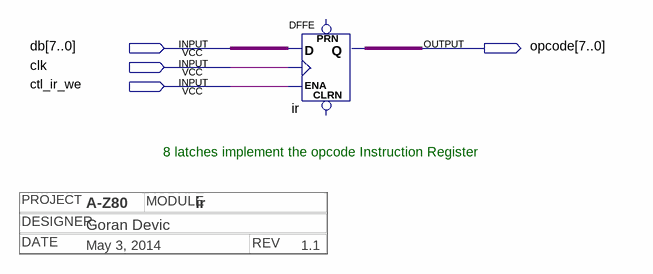
[diagram p0: schematic sheet]
// Quartus schematic ir.bdf as structural Verilog: 1 symbols, 4 pins
// Title block: PROJECT: A-Z80; MODULE: ir; DESIGNER: Goran Devic; DATE: May 3, 2014; REV: 1.1
module ir (
  input  [7:0] db,
  input  clk,
  input  ctl_ir_we,
  output [7:0] opcode
);

  DFFE ir[7:0] (.D(db), .CLK(clk), .ENA(ctl_ir_we), .Q(opcode));  // open: PRN, CLRN

  // Notes on the sheet:
  //   8 latches implement the opcode Instruction Register
endmodule
